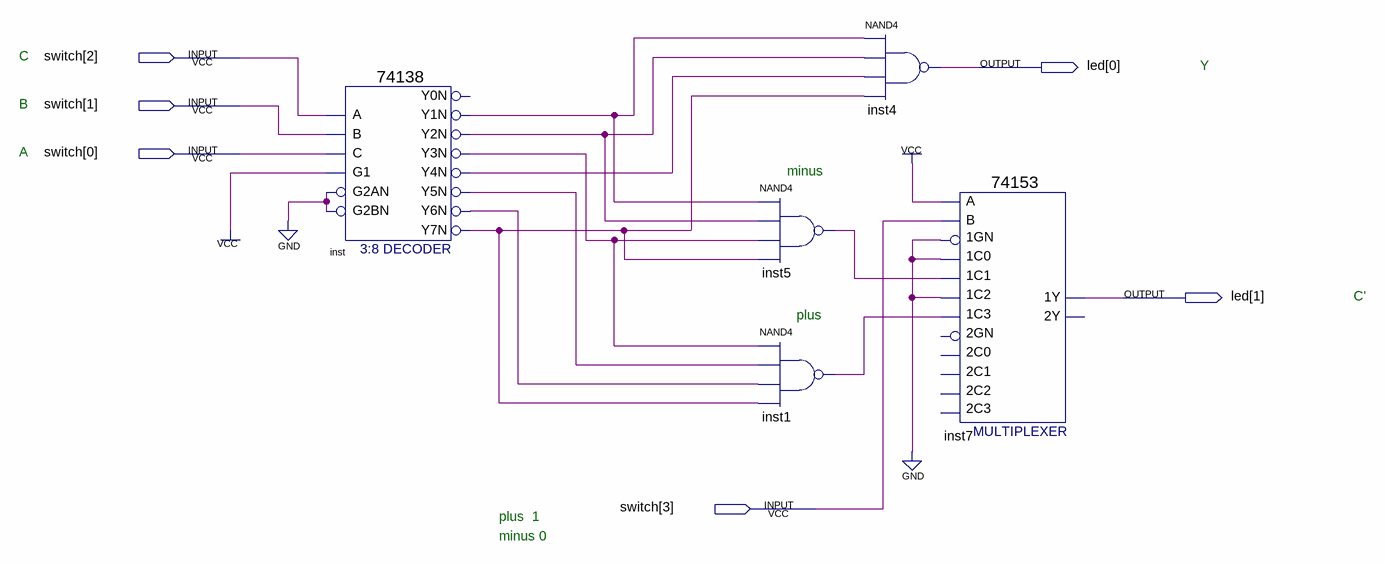
[diagram p0: schematic sheet]
// Quartus schematic pj405.bdf as structural Verilog: 5 symbols, 6 pins
module pj405 (
  input  [3:0] switch,
  output [1:0] led
);

  wire inst1_out, inst5_out, inst_y1n, inst_y2n, inst_y3n, inst_y4n, inst_y5n, inst_y6n, inst_y7n;

  \74138  inst (
    .A(switch[2]), .B(switch[1]), .G1(1'b1), .C(switch[0]), .G2AN(1'b0), .G2BN(1'b0), .Y1N(inst_y1n),
    .Y2N(inst_y2n), .Y3N(inst_y3n), .Y4N(inst_y4n), .Y5N(inst_y5n), .Y6N(inst_y6n), .Y7N(inst_y7n));  // open: Y0N
  nand inst5 (inst5_out, inst_y1n, inst_y2n, inst_y3n, inst_y7n);
  nand inst1 (inst1_out, inst_y3n, inst_y5n, inst_y6n, inst_y7n);
  nand inst4 (led[0], inst_y1n, inst_y2n, inst_y4n, inst_y7n);
  \74153  inst7 (
    .\1C1 (inst5_out), .\1GN (1'b0), .\1C0 (1'b0), .\1C2 (1'b0), .\1C3 (inst1_out), .B(switch[3]), .A(1'b1),
    .\1Y (led[1]));  // open: 2C0, 2GN, 2C2, 2C1, 2C3, 2Y

  // Notes on the sheet:
  //   C
  //   Y
  //   B
  //   A
  //   minus
  //   C'
  //   plus
  //   plus  1
  //   minus 0
endmodule
